# Altium schematic sheet main.SchDoc
size A3
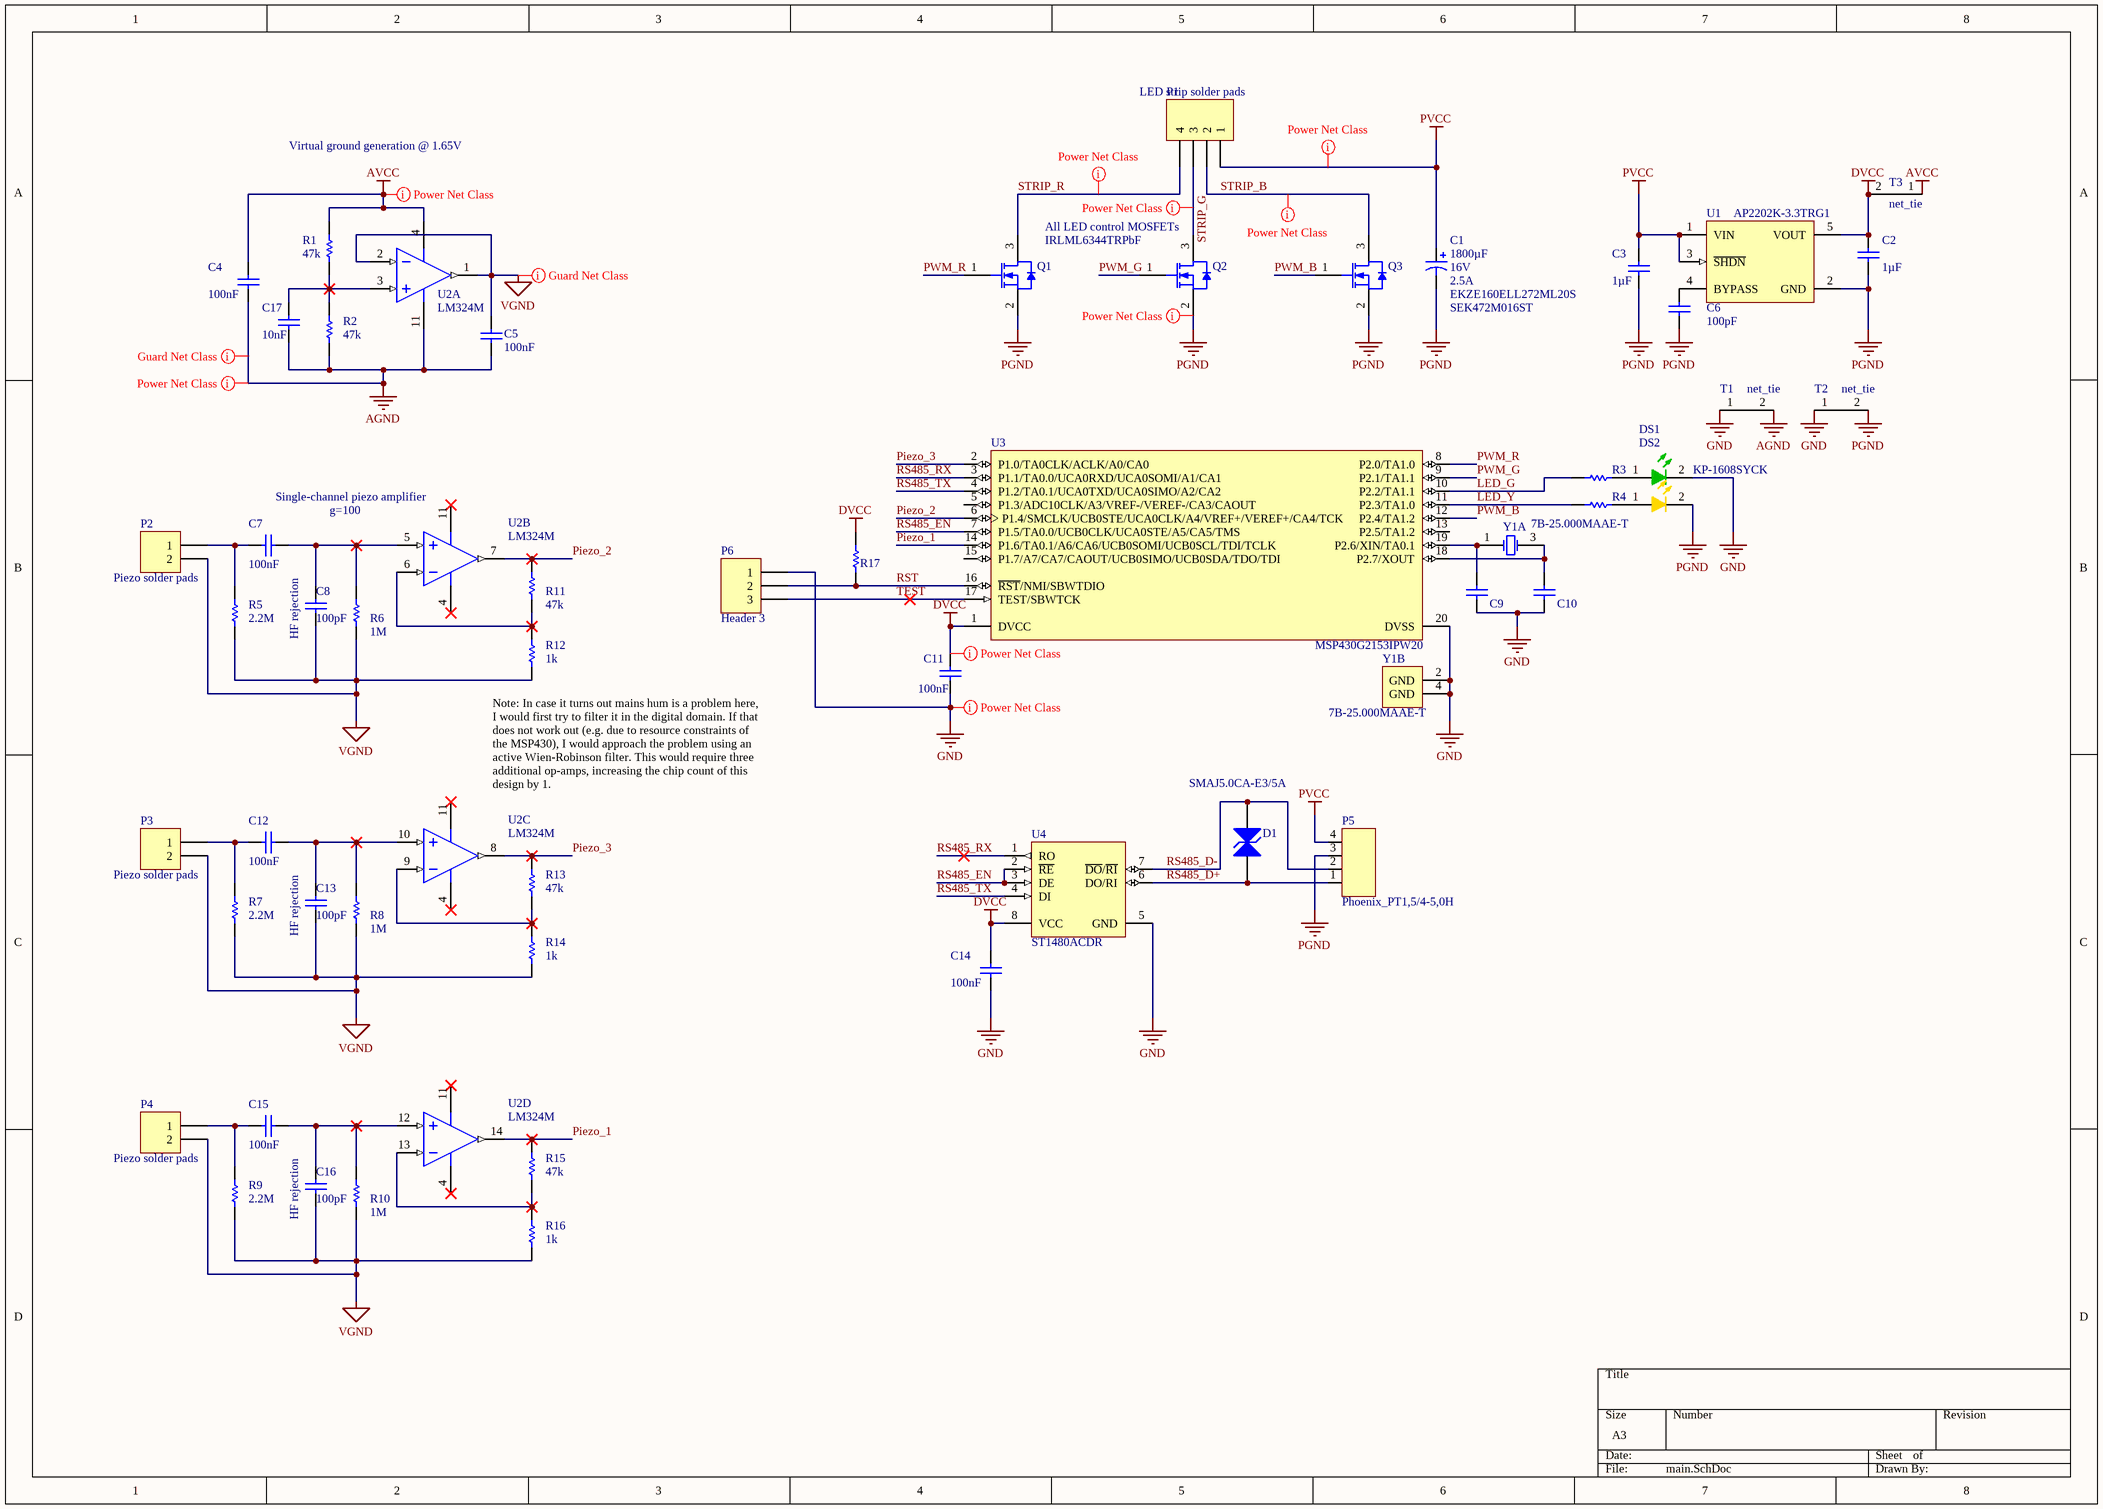
[diagram p0: main.SchDoc]

## Parts
C1  value 1800µF  VoltageRating: 16V  RippleCurrentRating: 2.5A  PartNumber: EKZE160ELL272ML20S  AltPartNumber: SEK472M016ST  [RB7.6-15]  (hidden comment: Cap Pol1)
C2  value 1µF  [CAPC0805(2012)145_L]  (hidden comment: CAP 10nF 100V 0805(2012))
C3  value 1µF  [CAPC0805(2012)145_L]  (hidden comment: CAP 10nF 100V 0805(2012))
C4  value 100nF  [CAPC0805(2012)145_L]  (hidden comment: CAP 10nF 100V 0805(2012))
C5  value 100nF  [CAPC0805(2012)145_L]  (hidden comment: CAP 10nF 100V 0805(2012))
C6  value 100pF  [CAPC0805(2012)145_L]  (hidden comment: CAP 10nF 100V 0805(2012))
C7  value 100nF  [CAPC0805(2012)145_L]  (hidden comment: CAP 10nF 100V 0805(2012))
C8  value 100pF  [CAPC0805(2012)145_L]  (hidden comment: CAP 10nF 100V 0805(2012))
C9  CAP 10nF 100V 0805(2012)  [CAPC0805(2012)145_L]  (value not drawn)
C10  CAP 10nF 100V 0805(2012)  [CAPC0805(2012)145_L]  (value not drawn)
C11  value 100nF  [CAPC0805(2012)145_L]  (hidden comment: CAP 10nF 100V 0805(2012))
C12  value 100nF  [CAPC0805(2012)145_L]  (hidden comment: CAP 10nF 100V 0805(2012))
C13  value 100pF  [CAPC0805(2012)145_L]  (hidden comment: CAP 10nF 100V 0805(2012))
C14  value 100nF  [CAPC0805(2012)145_L]  (hidden comment: CAP 10nF 100V 0805(2012))
C15  value 100nF  [CAPC0805(2012)145_L]  (hidden comment: CAP 10nF 100V 0805(2012))
C16  value 100pF  [CAPC0805(2012)145_L]  (hidden comment: CAP 10nF 100V 0805(2012))
C17  value 10nF  [CAPC0805(2012)145_L]  (hidden comment: CAP 10nF 100V 0805(2012))
D1  SMAJ5.0CA-E3/5A  [VISH-DO-214AC-2_N]
DS1  KP-1608MGC  [KING-0603LED_GREEN_V]  (value not drawn)
DS2  KP-1608SYCK  [KING-0603LED_YELLOW_V]
P1  Header 4  [HDR1X4]  (value not drawn)
P2  Piezo solder pads  [SMA_STANDING]
P3  Piezo solder pads  [SMA_STANDING]
P4  Piezo solder pads  [SMA_STANDING]
P5  Phoenix_PT1,5/4-5,0H  [Phoenix_PT_1,5/4-5,0-H]
P6  Header 3  [HDR1X3]
Q1  IRLML6344TRPbF  [AO-SOT23-3_V]  (value not drawn)
Q2  IRLML6344TRPbF  [AO-SOT23-3_V]
Q3  IRLML6344TRPbF  [AO-SOT23-3_V]  (value not drawn)
R1  value 47k  [RESC0805(2012)_N]  (hidden comment: 470K 1% 0805(2012))
R2  value 47k  [RESC0805(2012)_N]  (hidden comment: 470K 1% 0805(2012))
R3  470K 1% 0805(2012)  [RESC0805(2012)_N]  (value not drawn)
R4  470K 1% 0805(2012)  [RESC0805(2012)_N]  (value not drawn)
R5  value 2.2M  [RESC0805(2012)_N]  (hidden comment: 470K 1% 0805(2012))
R6  value 1M  [RESC0805(2012)_N]  (hidden comment: 470K 1% 0805(2012))
R7  value 2.2M  [RESC0805(2012)_N]  (hidden comment: 470K 1% 0805(2012))
R8  value 1M  [RESC0805(2012)_N]  (hidden comment: 470K 1% 0805(2012))
R9  value 2.2M  [RESC0805(2012)_N]  (hidden comment: 470K 1% 0805(2012))
R10  value 1M  [RESC0805(2012)_N]  (hidden comment: 470K 1% 0805(2012))
R11  value 47k  [RESC0805(2012)_N]  (hidden comment: 47K 1% 0805(2012))
R12  value 1k  [RESC0805(2012)_N]  (hidden comment: 470K 1% 0805(2012))
R13  value 47k  [RESC0805(2012)_N]  (hidden comment: 47K 1% 0805(2012))
R14  value 1k  [RESC0805(2012)_N]  (hidden comment: 470K 1% 0805(2012))
R15  value 47k  [RESC0805(2012)_N]  (hidden comment: 47K 1% 0805(2012))
R16  value 1k  [RESC0805(2012)_N]  (hidden comment: 470K 1% 0805(2012))
R17  10K 1% 0805(2012)  [RESC0805(2012)_N]  (value not drawn)
T1  net_tie  [NetTie]  (net tie, no BOM)
T2  net_tie  [NetTie]  (net tie, no BOM)
T3  net_tie  [NetTie]  (net tie, no BOM)
U1  AP2202K-3.3TRG1  [SOT-23-CT5_L]
U2  LM324M  [M14A_M]  (parts A,B,C,D of 4)
U3  MSP430G2153IPW20  [TI-PW20_N]
U4  ST1480ACDR  [M08A_N]
Y1  7B-25.000MAAE-T  [ABRA-ABM3B-4_V]  (parts A,B of 2)

## Nets
AGND: C4.2 C5.1 C17.2 R2.1 T1.2 U2.11(GND)
AVCC: C4.1 R1.2 T3.1 U2.4(V+)
DVCC: C2.1 C11.1 C14.2 R17.1 T3.2 U1.5(VOUT) U3.1(DVCC) U4.8(VCC)
GND: C9.2 C10.2 C11.2 C14.1 DS1.2(K) P6.1 T1.1 T2.1 U3.20(DVSS) U4.5(GND) Y1.2(GND) Y1.4(GND)
PGND: C1.2 C2.2 C3.2 C6.2 DS2.2(K) P5.3 Q1.2(S) Q2.2(S) Q3.2(S) T2.2 U1.2(GND)
PVCC: C1.1 C3.1 P1.1 P5.4 U1.1(VIN) U1.3(~{SHDN})
VGND: C5.2 C8.2 C13.2 C16.2 P2.2 P3.2 P4.2 R5.1 R6.1 R7.1 R8.1 R9.1 R10.1 R12.1 R14.1 R16.1 U2.1(OUT1) U2.2(IN1-)
LED_G: R3.2 U3.10(P2.2/TA1.1)
LED_Y: R4.2 U3.11(P2.3/TA1.0)
Piezo_1: R15.2 U2.14(OUT4) U3.14(P1.6/TA0.1/A6/CA6/UCB0SOMI/UCB0SCL/TDI/TCLK)
Piezo_2: R11.2 U2.7(OUT2) U3.6(P1.4/SMCLK/UCB0STE/UCA0CLK/A4/VREF+/VEREF+/CA4/TCK)
Piezo_3: R13.2 U2.8(OUT3) U3.2(P1.0/TA0CLK/ACLK/A0/CA0)
PWM_B: Q3.1(G) U3.12(P2.4/TA1.2)
PWM_G: Q2.1(G) U3.9(P2.1/TA1.1)
PWM_R: Q1.1(G) U3.8(P2.0/TA1.0)
RS485_D+: D1.1(A1) P5.1 U4.6(DO/RI)
RS485_D-: D1.2(A2) P5.2 U4.7(~{DO}/~{RI})
RS485_EN: U3.7(P1.5/TA0.0/UCB0CLK/UCA0STE/A5/CA5/TMS) U4.2(~{RE}) U4.3(DE)
RS485_RX: U3.3(P1.1/TA0.0/UCA0RXD/UCA0SOMI/A1/CA1) U4.1(RO)
RS485_TX: U3.4(P1.2/TA0.1/UCA0TXD/UCA0SIMO/A2/CA2) U4.4(DI)
RST: P6.2 R17.2 U3.16(~{RST}/NMI/SBWTDIO)
STRIP_B: P1.2 Q3.3(D)
STRIP_G: P1.3 Q2.3(D)
STRIP_R: P1.4 Q1.3(D)
TEST: P6.3 U3.17(TEST/SBWTCK)
NetC6_1: C6.1 U1.4(BYPASS)
NetC7_1: C7.1 P2.1 R5.2
NetC7_2: C7.2 C8.1 R6.2 U2.5(IN2+)
NetC9_1: C9.1 U3.19(P2.6/XIN/TA0.1) Y1.1(X1)
NetC10_1: C10.1 U3.18(P2.7/XOUT) Y1.3(X2)
NetC12_1: C12.1 P3.1 R7.2
NetC12_2: C12.2 C13.1 R8.2 U2.10(IN3+)
NetC15_1: C15.1 P4.1 R9.2
NetC15_2: C15.2 C16.1 R10.2 U2.12(IN4+)
NetC17_1: C17.1 R1.1 R2.2 U2.3(IN1+)
NetDS1_1: DS1.1(A) R3.1
NetDS2_1: DS2.1(A) R4.1
NetR11_1: R11.1 R12.2 U2.6(IN2-)
NetR13_1: R13.1 R14.2 U2.9(IN3-)
NetR15_1: R15.1 R16.2 U2.13(IN4-)

Not connected (* = marked no-connect by the designer): U3 5(P1.3/ADC10CLK/A3/VREF-/VEREF-/CA3/CAOUT) 13(P2.5/TA1.2) 15(P1.7/A7/CA7/CAOUT/UCB0SIMO/UCB0SDA/TDO/TDI)

## Layout directives
net class Power: AGND, AVCC, DVCC, GND, PGND, PVCC, STRIP_B, STRIP_G, STRIP_R
net class Guard: AGND, VGND

## Notes on the sheet
- (near P1) LED strip solder pads
- Virtual ground generation @ 1.65V
- All LED control MOSFETs
- Single-channel piezo amplifier
- g=100
- (near C8) HF rejection
- Note: In case it turns out mains hum is a problem here, I would first try to filter it in the digital domain. If that does not work out (e.g. due to resource constraints of the MSP430), I would approach the problem using an active Wien-Robinson filter. This would require three additional op-amps, increasing the chip count of this design by 1.
- (near C13) HF rejection
- (near C16) HF rejection

## Library data of the parts
C1 = Cap Pol1: Polarized Capacitor (Radial); Published: 8-Jun-2000; LatestRevisionDate: 17-Jul-2002; LatestRevisionNote: Re-released for DXP Platform.; PackageReference: RB7.6-15; Publisher: Altium Limited; PackageDescription: Polarized Capacitor (Radial); 2 Leads; Digikey: http://www.digikey.com/product-detail/en/EKZE160ELL272ML20S/565-1669-ND/756185; AltDigikey: http://www.digikey.com/product-detail/en/SEK472M016ST/338-2357-ND/1627227
C2 C6 = CMP-1036-03853-1: CAP 10nF 100V ±10% 0805 (2012 Metric) Thickness 1.45mm SMD; Rated Voltage: 4V; Case-EIA: 0805; Case-Metric: 2012; Max Thickness: 1.45 mm; Technology: SMT; Tolerance: ±10%
C3 = CMP-1036-03853-1: CAP 10nF 100V ±10% 0805 (2012 Metric) Thickness 1.45mm SMD; Rated Voltage: 16V; Case-EIA: 0805; Case-Metric: 2012; Max Thickness: 1.45 mm; Technology: SMT; Tolerance: ±10%
C4 C5 C7-C17 = CMP-1036-03853-1: CAP 10nF 100V ±10% 0805 (2012 Metric) Thickness 1.45mm SMD; Case-EIA: 0805; Case-Metric: 2012; Rated Voltage: 100 V; Max Thickness: 1.45 mm; Technology: SMT; Tolerance: ±10%
  C9 C10: Value: 10nF
D1 = CMP-0548-00276-2: Transient Voltage Suppressor, 6.40 to 231 V, 5 V Stand-off Voltage, Bi-Directional, -55 to 155 degC, 2-pin DO-214AC, Pb-Free, Tape and Reel; Manufacturer: Vishay Semiconductor; PPPM (W): 400, 300; VBR Bi-Directional (V): 6.4 to 231; ID (uA): 1600; IFSM: 40 A; VWM (V): 5; RoHS: TRUE; Operating Junction and Storage Temperature Range: -55 to 150 degC; Packing: Tape and Reel; ComponentLink1URL: http://www.vishay.com/; Mounting Technology: Surface Mount; ComponentLink2URL: http://www.vishay.com/docs/88390/smaj50a.pdf; PartNumber: SMAJ5.0CA-E3/5A; PackageReference: DO-214AC-2; ComponentLink1Description: Manufacturer URL; ComponentLink3Description: Package Specification; ComponentLink2Description: Datasheet; PackageDescription: 2-Pin DO-214AC (SMA), Body 4.245 x 2.665 mm; DatasheetVersion: 12/8/2013; ComponentLink3URL: http://www.vishay.com/docs/88390/smaj50a.pdf; digikey: http://www.digikey.com/product-detail/en/SMAJ5.0CA-E3%2F61/SMAJ5.0CA-E3%2F61GICT-ND/1091642
DS1 = CMP-0404-00001-1: LED, SMT, 0603(1608), 1.1mm thickness, Green; Manufacturer: Kingbright; Reverse Voltage: 5 V; Power Dissipation: 75 mW; Forward Current: 30 mA; Packing Type: 2000 pcs / reel; Mounting Technology: Surface Mount; Storage Temperature: -40 to +85 degC; ComponentLink1URL: http://www.kingbright.com/; PackageDescription: 2-Pin SMT LED, 1.6 x 0.8 mm Pitch; PartNumber: KP-1608MGC; PackageReference: 0603LED_GREEN; ComponentLink1Description: Manufacturer URL
DS2 = CMP-0404-00003-1: LED, SMT, 0603(1608), 1.1mm thickness, Yellow; Manufacturer: Kingbright; Reverse Voltage: 5 V; Packing Type: 2000 pcs / reel; Forward Current: 30 mA; Power Dissipation: 75 mW; ComponentLink2URL: http://www.kingbright.com/manager/upload/pdf/(1366274739)KP-1608SYCK(Ver.18B).pdf; PartNumber: KP-1608SYCK; ComponentLink1URL: http://www.kingbright.com/; ComponentLink2Description: Datasheet; PackageDescription: 2-Pin SMT LED, 1.6 x 0.8 mm Pitch; PackageReference: 0603LED_YELLOW; ComponentLink1Description: Manufacturer URL; Storage Temperature: -40 to +85 degC; Mounting Technology: Surface Mount
P1 = Header 4: Header, 4-Pin; LatestRevisionDate: 17-Jul-2002; LatestRevisionNote: Re-released for DXP Platform.; Publisher: Altium Limited
P2-P4 = Header 2: Header, 2-Pin; LatestRevisionDate: 17-Jul-2002; LatestRevisionNote: Re-released for DXP Platform.; Publisher: Altium Limited
P5 = Phoenix_PT1,5/4-5,0H: Conrad part no: 744180-62
P6 = Header 3: Header, 3-Pin; LatestRevisionDate: 17-Jul-2002; LatestRevisionNote: Re-released for DXP Platform.; Publisher: Altium Limited
Q1-Q3 = CMP-0278-00001-1: N-channel Enhancement Mode Field-Effect Transistor; 5.8A/30V; Manufacturer: Alpha and Omega; PartNumber: AO3400; Channel Type: N; Drain-Source Voltage Limit: 30 V; Junction Temperature: -55 to 150 degC; Gate-Source Voltage Limit: +/-12 V; PackageDescription: 3-Pin SOT23, 3.016 x 2.8 mm Body, 0.95 mm Pitch; ComponentLink2Description: Datasheet; DatasheetVersion: Rev.8, 12/2011; ComponentLink3URL: http://www.aosmd.com/res/packaging_information/SOT-23.pdf; Storage Temperature: -55 to 150 degC; ComponentLink3Description: Package Specification; PackageReference: SOT23; ComponentLink1Description: Manufacturer URL; Mounting Technology: Surface Mount; ComponentLink1URL: http://www.aosmd.com/; ComponentLink2URL: http://www.aosmd.com/res/data_sheets/AO3400.pdf
R1 R2 R5-R10 R12 R14 R16 R17 = CMP-1013-00812-1: 470K 0.125W 1% 0805 (2012 Metric)  SMD; Case-EIA: 0805; Case-Metric: 2012; Tolerance: 1 %; Power: 0.125 W; Technology: SMT
  R17: Value: 10k
R3 R4 = CMP-1013-00812-1: 470K 0.125W 1% 0805 (2012 Metric)  SMD; Case-EIA: 0805; Value: 470000.00 Ohm; Case-Metric: 2012; Tolerance: 1 %; Power: 0.125 W; Technology: SMT
R11 R13 R15 = CMP-1013-00812-1: 47K 0.125W 1% 0805 (2012 Metric)  SMD; Case-EIA: 0805; Case-Metric: 2012; Tolerance: 1 %; Power: 0.125 W; Technology: SMT
T1-T3 = net_tie: Net Tie
U1 = CMP-0136-00629-1: 50 mA, 100 mA and 150 mA CMOS LDOs with Active-Low Shutdown and Reference Bypass, 5-Pin SOT-23, Extended Temperature, Tape and Reel; PackageVersion: revBB, Aug-2009; Code_IPC: SOT23-5; PackageDescription: 5-Lead Plastic Small Outline Transistor (CT) [SOT-23]; DatasheetVersion: revE, Feb-2007; PackageReference: SOT-23-CT5
U2 = CMP-0055-00738-2: Low Power Quad Operational Amplifier, 14-pin Narrow SOIC; Manufacturer: National Semiconductor; CompType: Amplifiers; PackageTopMarking: NSUZXYTTE#*LM324M; PowerWise: N; Code_IPC: SOIC127P600-14; ComponentLink3URL: http://www.national.com/packaging/folders/m14a.html; DatasheetVersion: Aug-2000; ComponentLink1URL: http://www.national.com/ds/LM/LM324.pdf; RevisionNote: Component URLs added; ComponentLink2Description: LM324 Web Page; PackageReference: M14A; PackageVersion: revJ, Jan-1996; Code_JEDEC: MS-012AB; ComponentLink3Description: M14A Package Page; PinCount: 14; ComponentLink1Description: LM324 Datasheet; ComponentLink2URL: http://www.national.com/pf/LM/LM324.html; PackageDescription: Molded Package S.O., .150in Wide, 14 Lead; RoHS: N
U3 = CMP-0365-00610-1: 16 MHz Mixed Signal Microcontroller with 1 KB Flash, 256 B SRAM and 24 GPIOs, -40 to 85 degC, 20-pin SOP (PW), Green (RoHS & no Sb/Br); Manufacturer: Texas Instruments; Timers - 16-bit: 2; Brown Out Reset: Yes; SubFamily: Value Line; USCI_B (I2C & SPI): 1; SRAM(B): 256; ADC Channels: 8; GPIO: 24; Frequency(MHz): 16; ADC: 10-bit SAR; ComponentLink3URL: http://www.ti.com.cn/cn/lit/ml/mpds362/mpds362.pdf; ComponentLink1Description: Manufacturer URL; Cap touch I/O: Yes; Code_JEDEC: MO-153; ComponentLink2Description: Datasheet; ComponentLink3Description: Package Specification; Flash(KB): 1; Temp Sensor: Yes; Mounting Technology: Surface Mount; Watchdog: Yes; USCI_A (UART/LIN/IrDA/SPI): 1; ComponentLink2URL: http://www.ti.com/general/docs/lit/getliterature.tsp?genericPartNumber=MSP430G2153&fileType=pdf; PackageVersion: 4040064-5/G; ComponentLink1URL: http://www.ti.com/; DatasheetVersion: SLAS735G; Comparators: Yes; PartNumber: MSP430G2153IPW20; PackageDescription: 20-Pin Plastic Small Outline, Body 6.5 x 4.4 mm, 0.65 mm Pitch; PackageReference: PW20; Eco-Plan: Green (RoHS & no Sb/Br)
U4 = CMP-0058-00814-1: Multipoint RS-485/RS-422 Transceiver, 8-pin Narrow SOIC; Manufacturer: National Semiconductor; PackageTopMarking: NSZXTT*DS751*76BM; CompType: Interface IC; PowerWise: N; PackageReference: M08A; RoHS: N; PackageVersion: revM, May-2009; PinCount: 8; DatasheetVersion: Jul-2004; PackageDescription: SOIC Narrow, 4.9 x 3.9 x 1.45mm, 8 Lead, 1.27mm Pitch; Code_JEDEC: MS-012-AA; Code_IPC: SOIC127P600-8
Y1 = CMP-0277-00001-1: Crystal, SMD, 25.000000MHz Stab=50ppm 18.0pF; Manufacturer: Abracon; PartNumber: ABM3B-25.000MHZ-B2-T; Packing Type: Tape & Reel; Body Shape: Rectangular; Case Size: 5.0 x 3.2 mm; PackageDescription: 4-Pin SMT Crystal, 5.2 x 3.4 mm Body; ComponentLink2Description: Datasheet; Mounting Technology: Surface Mount; ComponentLink1URL: http://www.abracon.com/; PackageReference: ABM3B; DatasheetVersion: Apr-13; ComponentLink2URL: http://www.abracon.com/Resonators/abm3b.pdf; ComponentLink1Description: Manufacturer URL; Storage Temperature: -40 to 80 degC